# EasyEDA schematic SCH_Kumar-Semester-2-Capstone_2025-04-02.json
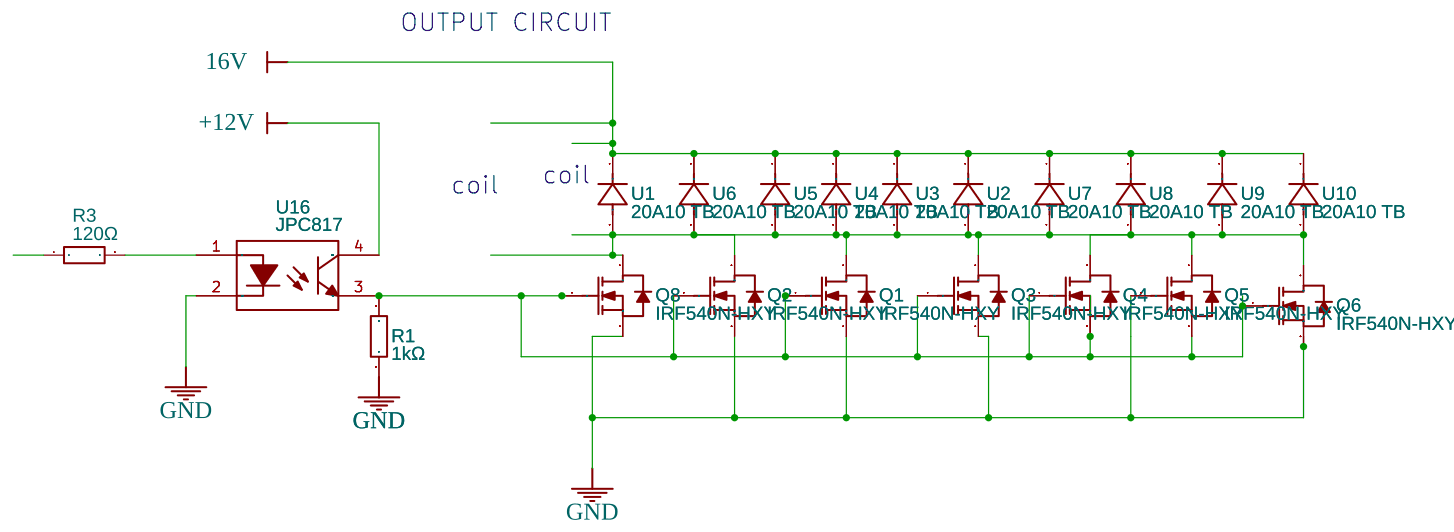
[diagram p0: schematic sheet]

## Parts
Q1  IRF540N-HXY  [TO-220-3_L10.0-W4.6-P2.54-L]
Q2  IRF540N-HXY  [TO-220-3_L10.0-W4.6-P2.54-L]
Q3  IRF540N-HXY  [TO-220-3_L10.0-W4.6-P2.54-L]
Q4  IRF540N-HXY  [TO-220-3_L10.0-W4.6-P2.54-L]
Q5  IRF540N-HXY  [TO-220-3_L10.0-W4.6-P2.54-L]
Q6  IRF540N-HXY  [TO-220-3_L10.0-W4.6-P2.54-L]
Q8  IRF540N-HXY  [TO-220-3_L10.0-W4.6-P2.54-L]
R1  1kΩ  [R0402]
R3  120Ω  [RES-TH_OHMITE_TA205PAXXXXXX]
U1  20A10 TB  [R-6_BD8.9-L8.9-P12.90-D1.3-RD]
U2  20A10 TB  [R-6_BD8.9-L8.9-P12.90-D1.3-RD]
U3  20A10 TB  [R-6_BD8.9-L8.9-P12.90-D1.3-RD]
U4  20A10 TB  [R-6_BD8.9-L8.9-P12.90-D1.3-RD]
U5  20A10 TB  [R-6_BD8.9-L8.9-P12.90-D1.3-RD]
U6  20A10 TB  [R-6_BD8.9-L8.9-P12.90-D1.3-RD]
U7  20A10 TB  [R-6_BD8.9-L8.9-P12.90-D1.3-RD]
U8  20A10 TB  [R-6_BD8.9-L8.9-P12.90-D1.3-RD]
U9  20A10 TB  [R-6_BD8.9-L8.9-P12.90-D1.3-RD]
U10  20A10 TB  [R-6_BD8.9-L8.9-P12.90-D1.3-RD]
U16  JPC817  [DIP-4_L6.5-W4.6-P2.54-LS7.6-BL]

## Library data of the parts
Q1-Q6 Q8 = IRF540N-HXY: Supplier: LCSC; Supplier Part: C19267787; Manufacturer: HXY MOSFET(华轩阳电子); Contributor: lcsc; JLCPCB Part Class: Extended Part
R1 = 0402 ±5% 1K: Contributor: lcsc; Supplier: LCSC; Supplier Part: C2889347; Manufacturer: VO(翔胜); JLCPCB Part Class: Extended Part
R3 = TA205PA120RJ: Contributor: LCSC; Supplier: LCSC; Supplier Part: C2647523; Manufacturer: Ohmite; JLCPCB Part Class: Extended Part
U1-U10 = 20A10 TB: Supplier: LCSC; Supplier Part: C5444211; Manufacturer: YFW(佑风微); JLCPCB Part Class: Extended Part; Contributor: lcsc
U16 = JPC817: Contributor: lcsc; Supplier: LCSC; Supplier Part: C5365399; Manufacturer: JUXING(钜兴); JLCPCB Part Class: Extended Part

## Nets
16V: U1.1(K) U2.1(K) U3.1(K) U4.1(K) U5.1(K) U6.1(K) U7.1(K) U8.1(K) U9.1(K) U10.1(K)
+12V: U16.4(Collector)
GND: Q1.3(S) Q2.3(S) Q3.3(S) Q5.1(G) Q6.3(S) Q8.3(S) R1.1 U16.2(Cathode)
Net-(Q1-1): Q1.1(G) Q2.1(G) Q3.1(G) Q4.1(G) Q4.3(S) Q5.3(S) Q6.1(G) Q8.1(G) R1.2 U16.3(Emitter)
Net-(Q1-2): Q1.2(D) Q2.2(D) Q3.2(D) Q4.2(D) Q5.2(D) Q6.2(D) Q8.2(D) U1.2(A) U2.2(A) U3.2(A) U4.2(A) U5.2(A) U6.2(A) U7.2(A) U8.2(A) U9.2(A) U10.2(A)
Net-(R3-2): R3.2 U16.1(Anode)

Not connected (* = marked no-connect by the designer): R3 1

## Notes on the sheet
- OUTPUT CIRCUIT
- coil
- coil
